# Altium schematic sheet 12V DCDC.SchDoc
size Letter; CompanyName: Penn Electric Racing; Organization: Penn Electric Racing; Address1: 220 S. 33rd St; Address2: Towne Bldg, B11; Address3: Philadelpia, PA 19104; Address4: USA; SheetNumber: 2; SheetTotal: 2
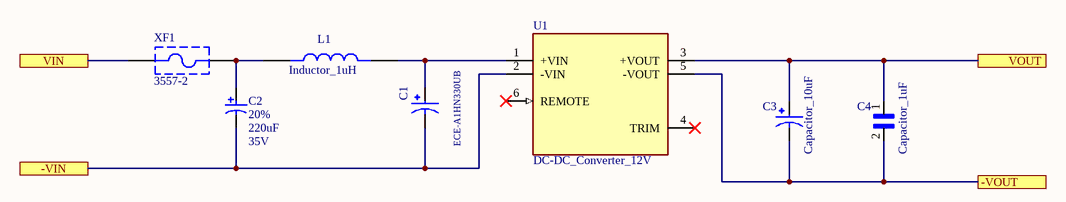
[diagram p0: 12V DCDC.SchDoc]

## Parts
C1  ECE-A1HN330UB  [Capacitor_33uF]
C2  value 220uF  Tolerance: 20%  Voltage: 35V  [NicCap_10x12.5]  (hidden comment: ESC227M035AH1AA)
C3  Capacitor_10uF  [Capacitor_10uF]
C4  Capacitor_1uF  [Capacitor_1uF]
L1  Inductor_1uH  [Inductor_1uH]
U1  DC-DC_Converter_12V  [DC-DC_Converter_12V]
XF1  3557-2  [KSTN-3557-2]

## Ports
-VIN, -VOUT, VIN, VOUT

## Nets
-VIN: C1.N C2.2 U1.2(-VIN) ; port -VIN
-VOUT: C3.N C4.2 U1.5(-VOUT) ; port -VOUT
VIN: XF1.1 ; port VIN
VOUT: C3.P C4.1 U1.3(+VOUT) ; port VOUT
NetC1_P: C1.P L1.2 U1.1(+VIN)
NetC2_1: C2.1 L1.1 XF1.2

Not connected (* = marked no-connect by the designer): U1 4(TRIM)* 6(REMOTE)*

## Notes on the sheet
- Title:
- Desc:
- Size:
- Letter
- Auth:
- Proj:
- Sheet
- of
- www.seas.upenn.edu
- Electrical and Systems Engineering

## Library data of the parts
C1 = Capacitor_33uF: Cap Aluminum 33uF 50V 20% (8 X 11.5mm) Radial 5mm 110mA 2000 hr 85°C Ammo Pack; Manufacturer: Panasonic; Life (Hours): 2000Hour; Lead Diameter: 0.6mm; Supplier 1: Mouser; Supplier Part Number 1: 667-ECE-A1HN330UB; Manufacturer Part Number: ECE-A1HN330UB; RoHS: Yes; Category: Aluminum Electrolytic Capacitors; Stock 1: 2771; Pricing 1: 1=0.89000, 10=0.62500, 50=0.47300, 100=0.41200, 500=0.30500, 1000=0.25900, 10000=0.25900 (USD); Mount: Through Hole; Case/Package: Radial; Min Operating Temperature: -40°C; Max Operating Temperature: 85°C; Capacitance: 33uF; Tolerance: 20%; Ripple Current: 110mA; Package Quantity: 1000; Termination: Radial; Series: SU; Voltage Rating: 50V; Packaging: Ammo Pack; Voltage Rating (DC): 50V; Construction: RADIAL; Diameter: 8mm; Length: 11.5mm; Height: 11.5mm; Lead Pitch: 5mm; Height - Seated (Max): 0.492inch; Radiation Hardening: No; ComponentLink1URL: https://datasheet.ciiva.com/24043/aba0000ce97-24043933.pdf?src-supplier=Mouser; ComponentLink1Description: https://datasheet.ciiva.com/24043/aba0000ce97-24043933.pdf?src-supplier=Mouser
C2 = CMP-3131333-1: Aluminum Electrolytic Capacitor, Polarized, Aluminum (wet), 35V, 20% +Tol, 20% -Tol, 220uF, Through Hole Mount; Manufacturer Series: ESC; Dielectric Material: Aluminium; Tan Delta: 0.1; Ripple Current: 560mA; Leakage Current: 77uA; Polarity: Polarized; Mount: Through Hole; Max Operating Temperature: 105°C; Length: 12mm; RoHS Compliant: Yes; Number of Pins: 2; Package Shape: Cylindrical; Min Operating Temperature: -40°C; Package Style: RadialMeter; Capacitor Type: Aluminium; Diameter: 10mm; Packaging: Bulk; Series: ESC; Terminal Pitch: 5mm; REACH SVHC: Yes; Termination: Wire
C3 = Capacitor_10uF: Cap Aluminum 10uF 50V 20% (6.3 X 5mm) Radial 2.5mm 35mA 1000 hr 85°C Bulk; Manufacturer: Panasonic; Manufacturer Part Number: ECE-A1HKS100; Polarity: Polar; Life (Hours): 1000Hour; Leakage Current: 3A; Lead Diameter: 0.45mm; Supplier 1: Arrow Electronics; Supplier Part Number 1: ECE-A1HKS100; RoHS: Yes; Category: Aluminum Electrolytic Capacitors; Stock 1: 3775; Pricing 1: 1=0.34520, 10=0.24180, 50=0.15970, 100=0.13540, 500=0.07970, 1000=0.07890, 2500=0.07540, 5000=0.07350 (USD); Mount: Through Hole,PCB; Case/Package: Radial; Number of Pins: 2; Weight: 0.01lb; Min Operating Temperature: -40°C; Max Operating Temperature: 85°C; Capacitance: 10uF; Packaging: Bulk; Ripple Current: 35mA; Tolerance: 20%; Voltage Rating: 50V; Package Quantity: 200; Voltage Rating (DC): 50V; Termination: Radial; Voltage: 50V; Series: KS; Construction: RADIAL; Ripple Current (AC): 35mA; Diameter: 6.3mm; Length: 5mm; Width: 0.5inch; Height: 5mm; Lead Pitch: 2.5mm; Height - Seated (Max): 0.197inch; Radiation Hardening: No; RoHS Compliant: Yes; REACH SVHC: No SVHC; Lead Free: Lead Free; ComponentLink1URL: https://datasheet.ciiva.com/11778/0900766b800274c4-11778985.pdf?src-supplier=RSComponents; ComponentLink1Description: https://datasheet.ciiva.com/11778/0900766b800274c4-11778985.pdf?src-supplier=RSComponents; ComponentLink2URL: https://datasheet.ciiva.com/2983/aba0000ce15-2983886.pdf?src-supplier=Avnet; ComponentLink2Description: https://datasheet.ciiva.com/2983/aba0000ce15-2983886.pdf?src-supplier=Avnet; ComponentLink3URL: https://datasheet.ciiva.com/43459/1339471-43459545.pdf?src-supplier=Farnell; ComponentLink3Description: https://datasheet.ciiva.com/43459/1339471-43459545.pdf?src-supplier=Farnell; ComponentLink4URL: https://datasheet.ciiva.com/24025/a-e-461514-24025641.pdf?src-supplier=Mouser; ComponentLink4Description: https://datasheet.ciiva.com/24025/a-e-461514-24025641.pdf?src-supplier=Mouser; ComponentLink5URL: https://datasheet.ciiva.com/16205/aba0000ce15-16205737.pdf?src-supplier=Future+Electronics; ComponentLink5Description: https://datasheet.ciiva.com/16205/aba0000ce15-16205737.pdf?src-supplier=Future+Electronics; ComponentLink6URL: https://datasheet.ciiva.com/46397/1339471-46397117.pdf?src-supplier=Element14; ComponentLink6Description: https://datasheet.ciiva.com/46397/1339471-46397117.pdf?src-supplier=Element14; ComponentLink7URL: https://datasheet.ciiva.com/15166/getdatasheetpartid-169217-15166123.pdf?src-supplier=Verical; ComponentLink7Description: https://datasheet.ciiva.com/15166/getdatasheetpartid-169217-15166123.pdf?src-supplier=Verical; ComponentLink8URL: https://datasheet.ciiva.com/14594/70067878-14594328.pdf?src-supplier=Allied+Electronics; ComponentLink8Description: https://datasheet.ciiva.com/14594/70067878-14594328.pdf?src-supplier=Allied+Electronics
C4 = Capacitor_1uF: Cap Ceramic 1uF 50V X5R 10% Radial 5mm 85C Ammo; Manufacturer: TDK; Manufacturer Part Number: FG28X5R1H105KRT06; Lead/Base Style: Kinked; Supplier 1: Arrow Electronics; Supplier Part Number 1: FG28X5R1H105KRT06; RoHS: Yes; Category: Ceramic Capacitors; Stock 1: 4381; Pricing 1: 1=0.32620, 10=0.20190, 25=0.19940, 100=0.13080, 250=0.12850, 500=0.09320, 1000=0.09090, 3000=0.07620 (USD); Mount: Through Hole; Case/Package: Radial; Min Operating Temperature: -55°C; Max Operating Temperature: 85°C; Packaging: Tape and Reel; Capacitance: 1uF; Voltage Rating: 50V; Tolerance: 10%; Length: 0.157inch; Width: 0.098inch; Height - Seated (Max): 0.217inch; Lead Pitch: 0.197inch; RoHS Compliant: Yes; ComponentLink1URL: https://product.tdk.com/info/en/catalog/datasheets/leadmlcc_halogenfree_fg_en.pdf?src-supplier=Digi-Key; ComponentLink1Description: https://product.tdk.com/info/en/catalog/datasheets/leadmlcc_halogenfree_fg_en.pdf?src-supplier=Digi-Key; ComponentLink2URL: https://product.tdk.com/info/en/documents/chara_sheet/FG28X5R1H105KRT06.pdf?src-supplier=Digi-Key; ComponentLink2Description: https://product.tdk.com/info/en/documents/chara_sheet/FG28X5R1H105KRT06.pdf?src-supplier=Digi-Key
L1 = Inductor_1uH: Inductor Power Drum Core 1uH 20% 7.96MHz 20Q-Factor Ferrite 3.5A 0.013Ohm DCR RDL Automotive Box; Manufacturer: Abracon; Manufacturer Part Number: AIUR-03-1R0M; Shielding: Unshielded; DC Resistance (DCR): 13mR; Self Resonant Frequency: 150MHz; Saturation Current: 10A; Supplier 1: Digi-Key; Supplier Part Number 1: AIUR-03-1R0M-ND; RoHS: Yes; Category: Fixed Inductors; Stock 1: 764; Pricing 1: 1=0.55000, 10=0.47800, 25=0.44360, 50=0.37540, 100=0.34120, 250=0.32076, 500=0.28664, 1000=0.23205, 2500=0.21840 (USD); Mount: Through Hole; Case/Package: Radial; Core Material: Ferrite; Min Operating Temperature: -40°C; Max Operating Temperature: 85°C; Package Quantity: 1000; Current Rating: 3.5A; Tolerance: 20%; Packaging: Bulk; Inductance: 1uH; Test Frequency: 7.96MHz; Resistor Type: Wirewound; Series: AIUR-03; Height: 0.472inch; Height - Seated (Max): 0.472inch; RoHS Compliant: Yes; ComponentLink1URL: https://datasheet.ciiva.com/6705/aiur-03-6705766.pdf?src-supplier=Digi-Key; ComponentLink1Description: https://datasheet.ciiva.com/6705/aiur-03-6705766.pdf?src-supplier=Digi-Key
U1 = DC-DC_Converter_12V: Isolated Module DC DC Converter 1 Output 12V - - 2.5A 9V - 36V Input
XF1 = CMP-000024-2: Fuse Holder; Auto; 2 in1 Blade; THM; 1 Fuse; Vertical; 30 Amps; ATO/ATC; FuseCurrent: 1A; FNet: LIDAR_DCDC; FuseVoltage: 32VDC